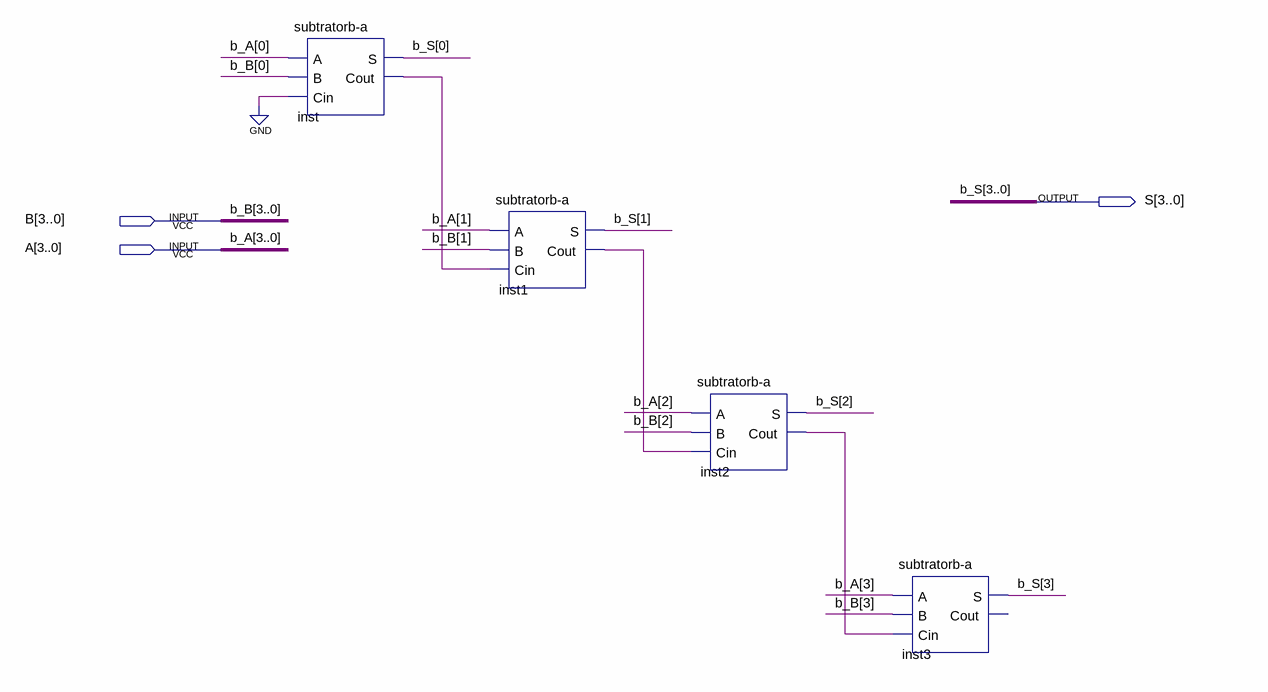
[diagram p0: schematic sheet]
// Quartus schematic subtracao.bdf as structural Verilog: 4 symbols, 3 pins
module subtracao (
  input  [3:0] B,
  input  [3:0] A,
  output [3:0] S
);

  wire inst1_cout, inst2_cout, inst_cout;

  \subtratorb-a  inst (.A(A[0]), .B(B[0]), .Cin(1'b0), .S(S[0]), .Cout(inst_cout));
  \subtratorb-a  inst1 (.A(A[1]), .B(B[1]), .Cin(inst_cout), .S(S[1]), .Cout(inst1_cout));
  \subtratorb-a  inst2 (.A(A[2]), .B(B[2]), .Cin(inst1_cout), .S(S[2]), .Cout(inst2_cout));
  \subtratorb-a  inst3 (.A(A[3]), .B(B[3]), .Cin(inst2_cout), .S(S[3]));  // open: Cout

  // Other names for the same wires on the sheet: b_A[3:0] = A; b_B[3:0] = B; b_S[3:0] = S
endmodule
